# EasyEDA schematic connect_4_robot_trimer_for_sensor.json
TITLE: Sheet_1; REV: 1.0; Date: 2025-11-19; Sheet: 1/1; Drawn By: AmirB; Company: Your Company
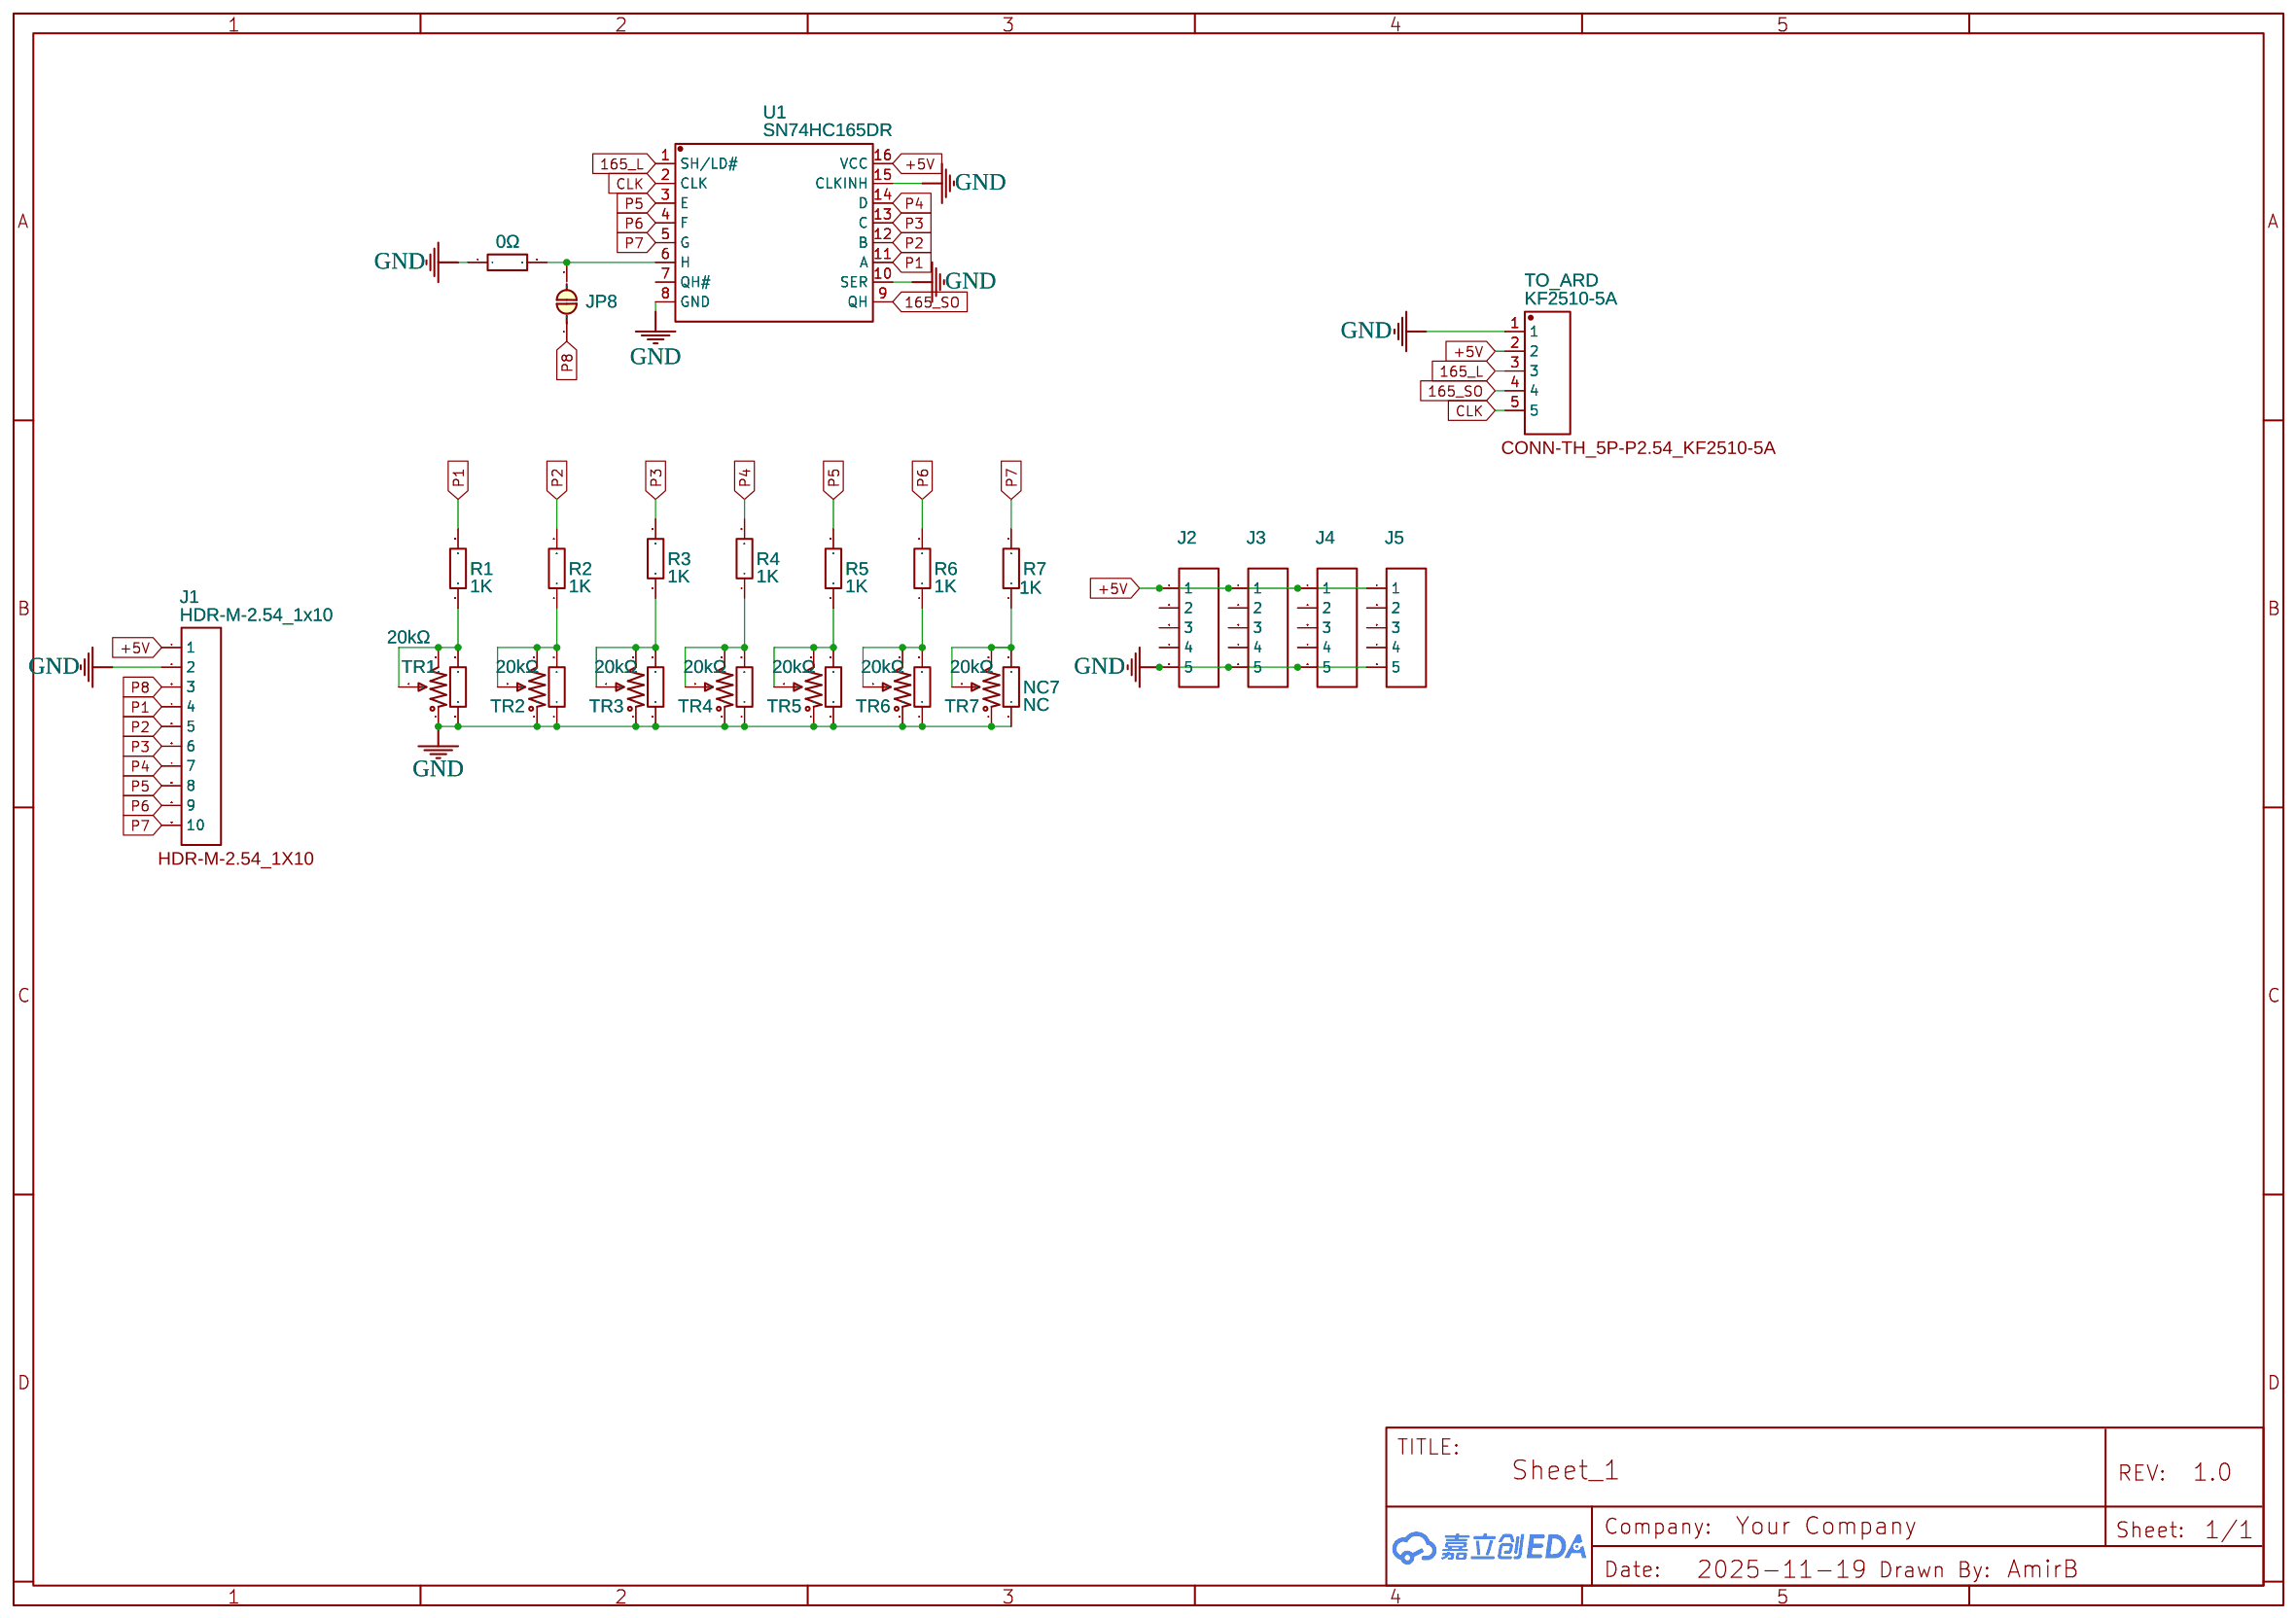
[diagram p0: schematic sheet]

## Parts
J1  HDR-M-2.54_1x10  [HDR-M-2.54_1X10]
J2  HDR-M-2.54_1x5  [HDR-M-2.54_1X5]
J3  HDR-M-2.54_1x5  [HDR-M-2.54_1X5]
J4  HDR-M-2.54_1x5  [HDR-M-2.54_1X5]
J5  HDR-M-2.54_1x5  [HDR-M-2.54_1X5]
JP8  JP  [JUMPERS_SMT-JUMPER_2_NC_PASTE_NO-SILK]
NC1  NC  [R0603]
NC2  NC  [R0603]
NC3  NC  [R0603]
NC4  NC  [R0603]
NC5  NC  [R0603]
NC6  NC  [R0603]
NC7  NC  [R0603]
R0  0Ω  [R0603]
R1  1K  [R0603]
R2  1K  [R0603]
R3  1K  [R0603]
R4  1K  [R0603]
R5  1K  [R0603]
R6  1K  [R0603]
R7  1K  [R0603]
TO_ARD  KF2510-5A  [CONN-TH_5P-P2.54_KF2510-5A]
TR1  20kΩ  [RES-ADJ-TH_3296W]
TR2  20kΩ  [RES-ADJ-TH_3296W]
TR3  20kΩ  [RES-ADJ-TH_3296W]
TR4  20kΩ  [RES-ADJ-TH_3296W]
TR5  20kΩ  [RES-ADJ-TH_3296W]
TR6  20kΩ  [RES-ADJ-TH_3296W]
TR7  20kΩ  [RES-ADJ-TH_3296W]
U1  SN74HC165DR  [SOP-16_L10.0-W3.9-P1.27-LS6.0-BL]

## Library data of the parts
J1 = HDR-M-2.54_1x10: Supplier Part: C57369; Supplier: LCSC; Contributor: LCEDA_Lib; Package Display: Yes
J2-J5 = HDR-M-2.54_1x5: Supplier Part: C358687; Supplier: LCSC; Contributor: LCEDA_Lib; Package Display: No
JP8 = JUMPER-SMT_2: Contributor: P-Thomsen; Package Display: No
NC1-NC7 = 0603WAF1001T5E: Supplier: LCSC; Manufacturer: UniOhm; Supplier Part: C21190; Resistance (Ohms): 1K; JLCPCB Part Class: Basic Part; Package Display: No
R0 = 0603WAF0000T5E: Supplier: LCSC; Manufacturer: UNI-ROYAL(厚声); Supplier Part: C21189; JLCPCB Part Class: Basic Part; Package Display: No
R1-R7 = 0603WAF1001T5E: Supplier: LCSC; Manufacturer: UniOhm; Supplier Part: C21190; JLCPCB Part Class: Basic Part; Package Display: No
TO_ARD = KF2510-5A: Supplier: LCSC; Manufacturer: BOOMELE(博穆精密); Supplier Part: C27544; JLCPCB Part Class: Extended Part; Package Display: Yes
TR1-TR7 = 3296W-1-202LF_C49190458: Supplier: LCSC; Supplier Part: C49190458; Manufacturer: JIERR(捷而瑞); JLCPCB Part Class: Extended Part; Contributor: lcsc; Package Display: No
U1 = SN74HC165DR: Supplier: LCSC; Manufacturer: TI(德州仪器); Supplier Part: C61060; JLCPCB Part Class: Extended Part; Package Display: No

## Nets
+5V: J1.1 J2.1 J3.1 J4.1 J5.1 TO_ARD.2 U1.16(VCC)
GND: J1.2 J2.5 J3.5 J4.5 J5.5 NC1.1 NC2.1 NC3.1 NC4.1 NC5.1 NC6.1 NC7.1 R0.1 TO_ARD.1 TR1.1 TR2.1 TR3.1 TR4.1 TR5.1 TR6.1 TR7.1 U1.8(GND) U1.10(SER) U1.15(CLKINH)
165_L: TO_ARD.3 U1.1(SH/LD#)
165_SO: TO_ARD.4 U1.9(QH)
CLK: TO_ARD.5 U1.2(CLK)
P1: J1.4 R1.2 U1.11(A)
P2: J1.5 R2.2 U1.12(B)
P3: J1.6 R3.2 U1.13(C)
P4: J1.7 R4.2 U1.14(D)
P5: J1.8 R5.2 U1.3(E)
P6: J1.9 R6.2 U1.4(F)
P7: J1.10 R7.2 U1.5(G)
P8: J1.3 JP8.1
Net-(JP8-2): JP8.2 R0.2 U1.6(H)
Net-(NC1-2): NC1.2 R1.1 TR1.2 TR1.3
Net-(NC2-2): NC2.2 R2.1 TR2.2 TR2.3
Net-(NC3-2): NC3.2 R3.1 TR3.2 TR3.3
Net-(NC4-2): NC4.2 R4.1 TR4.2 TR4.3
Net-(NC5-2): NC5.2 R5.1 TR5.2 TR5.3
Net-(NC6-2): NC6.2 R6.1 TR6.2 TR6.3
Net-(NC7-2): NC7.2 R7.1 TR7.2 TR7.3

Not connected (* = marked no-connect by the designer): J2 2 3 4; J3 2 3 4; J4 2 3 4; J5 2 3 4; U1 7(QH#)
